# EAGLE design 89c2051-pc-ps2 (EAGLE 4.16)
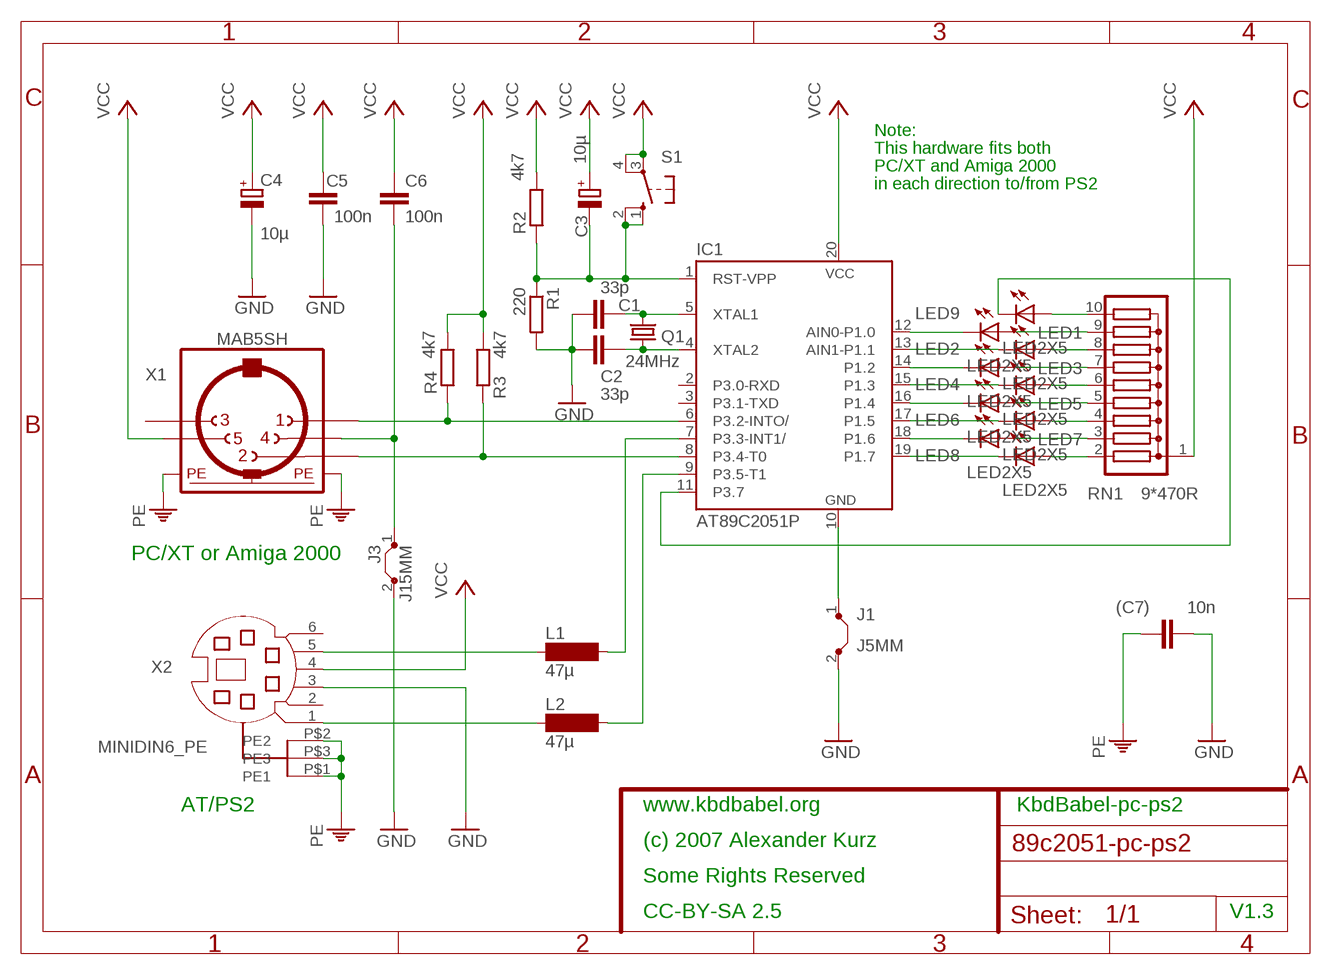
[diagram p0: schematic, sheet 1]

## Parts
(C7)  10n  C-EU025_050-025X075  [C025_050-025X075]
C1  33p  C-EU025-030X050  [C025-030X050]
C2  33p  C-EU025-030X050  [C025-030X050]
C3  10µ  CPOL-EUE2-5  [E2-5]
C4  10µ  CPOL-EUE2-5  [E2-5]
C5  100n  C-EU025_050-025X075  [C025_050-025X075]
C6  100n  C-EU025_050-025X075  [C025_050-025X075]
IC1  AT89C2051P  [DIL20]
J1  J5MM  [05]
J3  J15MM  [15]
L1  47µ  SD75  [SD75]
L2  47µ  SD75  [SD75]
LED1  LED2X5  [LED2X5]
LED2  LED2X5  [LED2X5]
LED3  LED2X5  [LED2X5]
LED4  LED2X5  [LED2X5]
LED5  LED2X5  [LED2X5]
LED6  LED2X5  [LED2X5]
LED7  LED2X5  [LED2X5]
LED8  LED2X5  [LED2X5]
LED9  LED2X5  [LED2X5]
Q1  24MHz  CRYSTALHC49U70  [HC49U70]
R1  220  R-EU_0204/7  [0204/7]
R2  4k7  R-EU_0204/7  [0204/7]
R3  4k7  R-EU_0204/7  [0204/7]
R4  4k7  R-EU_0204/7  [0204/7]
RN1  9*470R  G09R  [SIL10]
S1  10-XX  [B3F-10XX]
X1  MAB5SH  [MAB5SH]
X2  MINIDIN6_PE  [MINIDIN6_PE]

## Nets
GND: (C7).1 C1.1 C2.2 C4.- C5.1 J1.2 J3.2 R1.2 X2.3
N$1: C1.2 IC1.5(XTAL1) Q1.2
N$2: C2.1 IC1.4(XTAL2) Q1.1
N$3: IC1.10(GND) J1.1
N$4: LED9.A RN1.10
N$5: LED1.A RN1.9
N$6: L1.1 X2.5
N$7: IC1.6(P3.2-INTO/) R4.2 X1.1
N$8: LED2.A RN1.8
N$9: C3.- IC1.1(RST-VPP) R1.1 R2.2 S1.1(S) S1.2(S1)
N$10: IC1.8(P3.4-T0) R3.2 X1.2
N$11: IC1.7(P3.3-INT1/) L1.2
N$12: IC1.9(P3.5-T1) L2.2
N$13: LED3.A RN1.7
N$14: LED4.A RN1.6
N$15: LED5.A RN1.5
N$16: LED6.A RN1.4
N$17: LED7.A RN1.3
N$18: LED8.A RN1.2
N$19: IC1.19(P1.7) LED8.K(C)
N$20: IC1.18(P1.6) LED7.K(C)
N$21: IC1.17(P1.5) LED6.K(C)
N$22: IC1.16(P1.4) LED5.K(C)
N$23: IC1.15(P1.3) LED4.K(C)
N$24: IC1.14(P1.2) LED3.K(C)
N$25: IC1.13(AIN1-P1.1) LED2.K(C)
N$26: L2.1 X2.1
N$27: IC1.12(AIN0-P1.0) LED1.K(C)
N$28: IC1.11(P3.7) LED9.K(C)
N$29: C6.1 J3.1 X1.4
PE: (C7).2 X1.PE X1.PE@(PE) X2.P$1(PE1) X2.P$2(PE2) X2.P$3(PE3)
VCC: C3.+ C4.+ C5.2 C6.2 IC1.20(VCC) R2.1 R3.1 R4.1 RN1.1 S1.3(P) S1.4(P1) X1.5 X2.4
Unconnected: IC1.2(P3.0-RXD) IC1.3(P3.1-TXD) X1.3 X2.2 X2.6

## Notes on the sheet
- Note:
- This hardware fits both
- PC/XT and Amiga 2000
- in each direction to/from PS2
- PC/XT or Amiga 2000
- AT/PS2 | www.kbdbabel.org | KbdBabel-pc-ps2
- (c) 2007 Alexander Kurz
- Some Rights Reserved
- CC-BY-SA 2.5 | V1.3

## Library data of the parts
(C7) C1 C2 C5 C6 = rcl:C-EU: CAPACITOR, European symbol
C3 C4 = rcl:CPOL-EU: POLARIZED CAPACITOR, European symbol
IC1 = atmel:AT89C2051: 80C31 MICROCONTROLLER 2 Kbytes FLASH 2.7 V
J1 J3 = jumper:J: Bridge
L1 L2 = inductor-neosid:SD75: INDUCTOR nominal inductance, E12
LED1-LED9 = bla:LED
Q1 = crystal:CRYSTAL: CRYSTAL
R1-R4 = rcl:R-EU_: RESISTOR, European symbol
RN1 = resistor-sil:G09R: SIL RESISTOR
S1 = switch-omron:10-XX: OMRON SWITCH
X1 = con-hirschmann:MAB5SH: Female CONNECTOR 5 pins 90 deg. with shield, horizontal (DIN 41524)
X2 = bla:MINIDIN6_PE

## Board
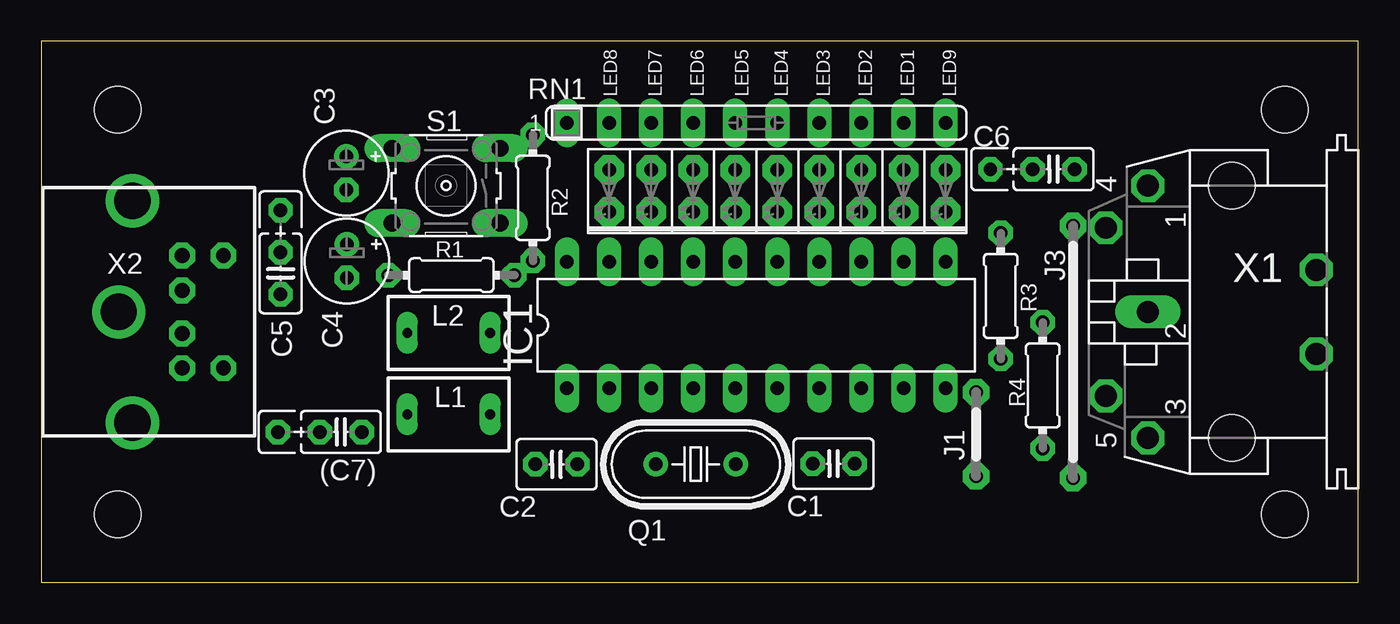
[diagram p1: board, top side]
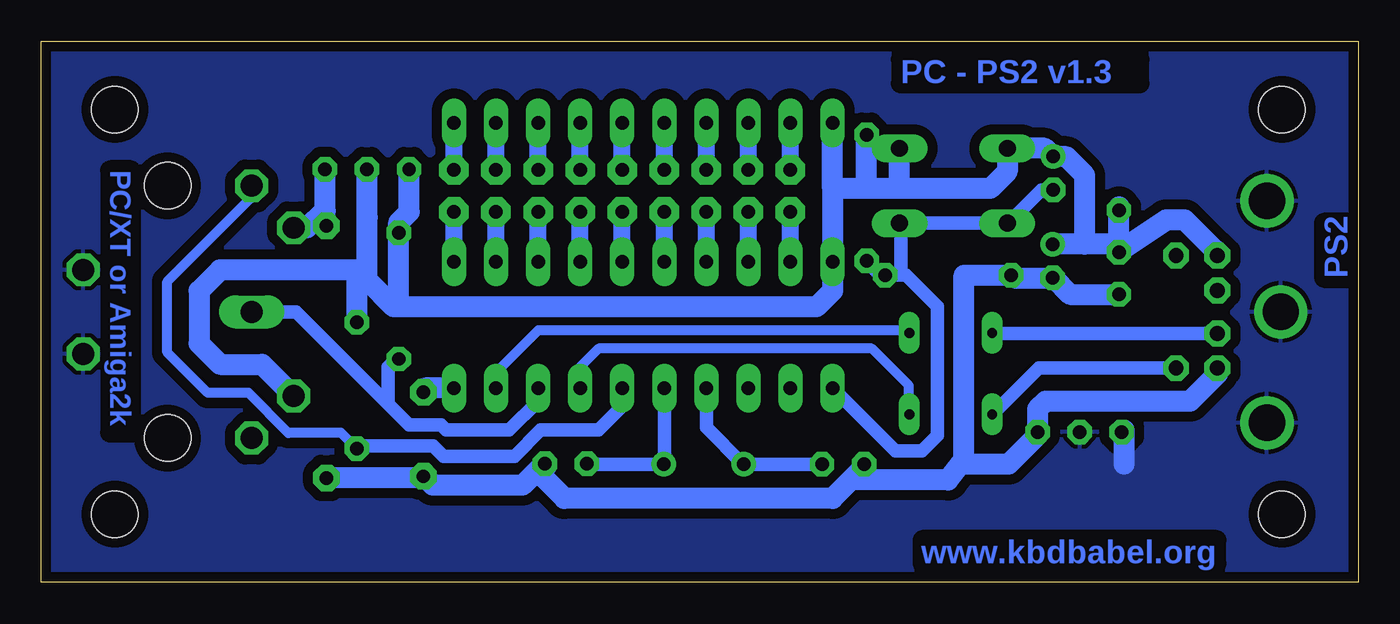
[diagram p2: board, bottom side, seen from below]

Size 79.52 x 32.69 mm. Coordinates in mm from the lower left corner, seen from the top.
Outline: 79.52,0 79.52,32.69 0,32.69 0,0 79.52,0
Copper layers (1*16): Top 0.035mm / dielectric 1.5mm / Bottom 0.035mm
Design rules "default": minimum track width 16mil, minimum drill 24mil, track to track 16mil, track to pad 16mil, pad to pad 16mil, via to via 16mil, smd to smd 16mil, copper to edge 20mil, drill to drill 8mil, minimum pad ring 13mil, minimum via ring 8mil, stop-mask expansion 4mil, vias tented up to drill 0mil, thermal gap 10mil
Holes 2.8 mm at 75.08,4.12 75.08,28.57 4.6,28.57 4.6,4.12

### Footprints (pad centres in the part's own frame; a part is rotated, then mirrored left to right if it is on the bottom)
C025_050-025X075 = drill 0.813 octagon: 1 -1.27,0; 2 1.27,0; 3 3.81,0
C025-030X050 = drill 0.813 octagon: 1 -1.27,0; 2 1.27,0
E2-5 = drill 0.813 pad 1.27 round: + -1.016,0 | drill 0.813 pad 1.27 octagon: - 1.016,0
DIL20 = drill 0.813 long: 1 -11.43,-3.81; 2 -8.89,-3.81; 3 -6.35,-3.81; 4 -3.81,-3.81; 5 -1.27,-3.81; 6 1.27,-3.81; 7 3.81,-3.81; 8 6.35,-3.81; 9 8.89,-3.81; 10 11.43,-3.81; 11 11.43,3.81; 12 8.89,3.81; 13 6.35,3.81; 14 3.81,3.81; 15 1.27,3.81; 16 -1.27,3.81; 17 -3.81,3.81; 18 -6.35,3.81; 19 -8.89,3.81; 20 -11.43,3.81
05 = drill 0.813 pad 1.6 octagon: 1 -2.54,0; 2 2.54,0
15 = drill 0.813 pad 1.6 octagon: 1 -7.62,0; 2 7.62,0
SD75 = drill 0.6 long: 1 -2.5,0; 2 2.5,0
LED2X5 = drill 0.813 pad 1.778 octagon: A -1.27,0; K 1.27,0
HC49U70 = drill 0.813 round: 1 -2.413,0; 2 2.413,0
0204/7 = drill 0.813 octagon: 1 -3.81,0; 2 3.81,0
SIL10 = drill 0.813 long: 1 -11.43,0; 2 -8.89,0; 3 -6.35,0; 4 -3.81,0; 5 -1.27,0; 6 1.27,0; 7 3.81,0; 8 6.35,0; 9 8.89,0; 10 11.43,0
B3F-10XX = drill 1.016 long: 1 -3.251,2.261; 2 3.251,2.261; 3 -3.251,-2.261; 4 3.251,-2.261
MAB5SH = drill 1.321 octagon: 1 7.62,5.08; 3 -7.62,5.08; 4 5.08,7.62; 5 -5.08,7.62; PE -2.54,-5.08; PE@ 2.54,-5.08 | drill 1.321 long: 2 0,5.08 | hole 2.794: 7.62,0; -7.62,0
MINIDIN6_PE = drill 0.9 octagon: 1 1.3,2.15; 2 -1.3,2.15; 3 3.4,2.15; 4 -3.4,2.15; 5 3.4,4.65; 6 -3.4,4.65 | drill 2.2 round: P$1 0,-1.676; P$2 -6.706,-0.838; P$3 6.706,-0.838

### Placement (x,y rotation side)
(C7)  18.09,9.09 180 top
C1  47.84,7.17 180 top
C2  31.11,7.14 180 top
C3  18.41,24.73 270 top
C4  18.44,19.42 270 top
C5  14.45,18.68 90 top
C6  61.13,24.97 180 top
IC1  43.17,15.55 0 top
J1  56.45,8.95 270 top
J3  62.3,13.93 270 top
L1  24.6,10.15 0 top
L2  24.6,15.08 0 top
LED1  52.06,23.65 270 top
LED2  49.52,23.65 270 top
LED3  46.98,23.65 270 top
LED4  44.44,23.65 270 top
LED5  41.91,23.65 270 top
LED6  39.36,23.65 270 top
LED7  36.83,23.65 270 top
LED8  34.28,23.65 270 top
LED9  54.6,23.65 270 top
Q1  39.52,7.14 0 top
R1  24.76,18.57 180 top
R2  29.68,23.23 270 top
R3  57.94,17.31 270 top
R4  60.48,11.9 270 top
RN1  43.17,27.78 0 top
S1  24.44,23.96 180 top
X1  71.91,16.34 90 top
X2  6.34,16.34 270 top

### Tracks (layer width: path | path; a pad name or v marks a point on that pad's centre or on a via)
GND
  Bottom 1.27: J1.2 56.55,6.31 J3.2 | J1.2 56.26,6.41 | 49.18,7.17 49.21,7.14 | 49.21,7.14 49.05,6.98 | 49.18,7.17 C1.1 49.11,7.23 | 49.18,7.17 50.48,5.87 55.87,5.87 56.45,6.44 | 56.45,6.44 56.51,6.5 | 56.45,6.44 J1.2 | C2.2 | C2.2 29.84,6.98 30.4,6.42 | 30.63,6.18 30.4,6.42 | 30.63,6.18 31.74,5.07 47.94,5.07 49.21,6.34 49.21,7.14 | 49.11,7.23 49.05,7.3 | 49.21,7.14 49.11,7.23 | C2.2 | 24.02,7.18 23.81,7.45 23.81,18.57 R1.2 | 24.02,7.18 24.76,6.18 30.63,6.18 | 30.63,6.18 30.4,6.42 | 30.4,6.42 | R1.2 | C5.1 17.41,17.41 18.41,18.41 18.42,18.4 C4.- 20.78,18.4 R1.2 | R1.2 | X2.3 8.49,12.61 10.15,10.95 18.89,10.95 19.36,10.47 19.36,9.04 19.36,9.05 | 19.36,9.05 (C7).1 | 19.36,9.05 19.36,8.89 21.11,7.14 23.97,7.14 24,7.18 24.02,7.18
N$1
  Bottom 0.61: Q1.2 41.9,7.14 | 46.67,7.14 46.64,7.17 C1.2
  Bottom 0.813: 41.9,7.14 IC1.5 | Q1.2 46.67,7.14
N$2
  Bottom 0.61: 36.98,7.14 Q1.1 37.14,7.14 | 36.98,7.14
  Bottom 0.813: C2.1 36.98,7.14 | IC1.4 39.36,9.36 37.14,7.14
N$3
  Bottom 1.27: J1.1 56.45,11.52 56.51,11.58 56.35,11.74 IC1.10
N$4
  Bottom 1.016: LED9.A RN1.10
N$5
  Bottom 1.016: LED1.A RN1.9
N$6
  Bottom 0.813: L1.1 21.74,10.47 19.27,12.94 X2.5
N$7
  Bottom 0.406: X1.1 66.73,23.96
  Bottom 0.61: 64.61,9.04 67.02,11.46 69.47,11.46 71.92,13.89 71.92,18.17 66.88,23.22 66.88,23.25 66.92,23.3 66.83,23.39 X1.1 | 64.61,9.04 64.59,9.03 | 64.61,9.04 61.43,9.04 R4.2 60.64,8.09
  Bottom 0.813: IC1.6 44.44,10.63 45.87,9.2 49.37,9.2 50.95,7.61 55.24,7.61 55.87,8.25 60.32,8.25 R4.2
N$8
  Bottom 1.016: LED2.A RN1.8
N$9
  Bottom 0.813: 27.62,18.57 27.3,18.57 25.39,16.66 25.39,8.88 26.35,7.93 27.93,7.93 IC1.1 | 27.62,18.57 R1.1 28.89,18.57 29.68,19.36 R2.2 | 27.62,21.7 S1.1 | 27.62,18.57 27.62,21.7 | 27.62,21.7 S1.2 | S1.2 21.11,21.7 21.11,21.74 | 21.19,21.66 21.27,21.58 | S1.2 21.19,21.66 | C3.- 19.14,23.71 21.19,21.66 | IC1.1
N$10
  Bottom 0.813: IC1.8 49.52,10.95 51.27,9.2 55.08,9.2 55.4,9.52 57.3,9.52 58.57,10.79 | 58.57,10.79 64.13,16.34 X1.2 | R3.2 58.08,13.5 58.57,13.01 58.57,10.79 | 58.57,10.79
N$11
  Bottom 0.61: IC1.7 46.98,13.01 45.87,14.12 29.36,14.12 27.14,11.9 27.14,10.15 L1.2
N$12
  Bottom 0.61: IC1.9 52.06,12.69 49.52,15.23 27.3,15.23 27.14,15.07 L2.2
N$13
  Bottom 1.016: LED3.A | LED3.A RN1.7
N$14
  Bottom 1.016: LED4.A RN1.6
N$15
  Bottom 1.016: LED5.A | LED5.A RN1.5
N$16
  Bottom 1.016: LED6.A RN1.4
N$17
  Bottom 1.016: LED7.A | LED7.A RN1.3
N$18
  Bottom 1.016: LED8.A RN1.2
N$19
  Bottom 1.016: IC1.19 LED8.K
N$20
  Bottom 1.016: LED7.K | IC1.18 LED7.K
N$21
  Bottom 1.016: IC1.17 LED6.K
N$22
  Bottom 1.016: LED5.K | IC1.16 LED5.K
N$23
  Bottom 1.016: IC1.15 LED4.K
N$24
  Bottom 1.016: LED3.K | LED3.K | IC1.14 LED3.K
N$25
  Bottom 1.016: IC1.13 LED2.K
N$26
  Bottom 0.813: L2.1 21.74,15.07 21.74,15.04 X2.1
N$27
  Bottom 1.016: IC1.12 LED1.K
N$28
  Bottom 1.016: 54.6,22.54 LED9.K IC1.11
N$29
  Bottom 0.813: 64.29,21.22 X1.4 | 62.46,22.44 J3.1 62.26,22.34
  Bottom 1.27: 64.29,21.22 64.09,21.42 63.48,21.42 62.46,22.44 62.38,22.44 C6.1 | C6.1 62.38,25.08 | C6.1
PE
  Bottom 1.27: 14.12,7.14 14.12,9.2
  pour Bottom (isolate 0.61): 79.67,-0.13 79.64,32.85 -0.18,32.85 -0.14,-0.1
VCC
  Bottom 1.27: X1.5 66.19,13.17 68.73,13.17 70,14.44 70,17.61 68.73,18.88 60.48,18.88 | 60.48,18.88 R4.1 | X2.4 8.65,20.08 10.47,21.9 11.58,21.9 14.44,20 | 14.44,20 14.45,20 C5.2 | S1.4 21.15,26.23 21.11,26.19 | 18.41,25.71 | 18.41,25.71 C3.+ | S1.4 18.92,26.23 18.41,25.71 | C5.2 14.44,19.84 | 14.44,20 C5.2 | 14.44,20 14.44,20.43 | 14.44,20.43 16.5,20.43 | 16.5,20.43 C4.+ | 14.44,20.43 14.44,20.47 | IC1.20 31.74,17.61 32.72,16.64 57.94,16.64 | IC1.20 | 31.74,23.81 IC1.20 | 18.41,25.71 17.62,25.71 16.5,24.6 16.5,20.43 | 14.44,20 14.44,22.69 | S1.4 21.19,24.83 22.22,23.81 27.78,23.81 | 27.78,23.81 29.68,23.81 | 29.68,23.81 31.74,23.81 | 29.68,23.81 R2.1 | S1.3 27.69,23.89 27.78,23.81 | 31.74,23.81 RN1.1 | 57.94,16.64 58.24,16.64 59.76,18.17 | 59.76,18.17 59.84,18.25 | 59.84,18.25 60.48,18.88 | 59.84,18.25 59.86,18.26 | 57.94,16.64 57.94,21.11 | 57.94,21.11 R3.1 | C6.2 59.86,22.07 59.84,22.06 59.84,18.09 59.76,18.17 | 57.3,24.92 57.3,22.38 57.94,21.74 57.94,21.11

### Text on the board
Bottom: PC - PS2 v1.3 | PC/XT or Amiga2k | PS2 | www.kbdbabel.org